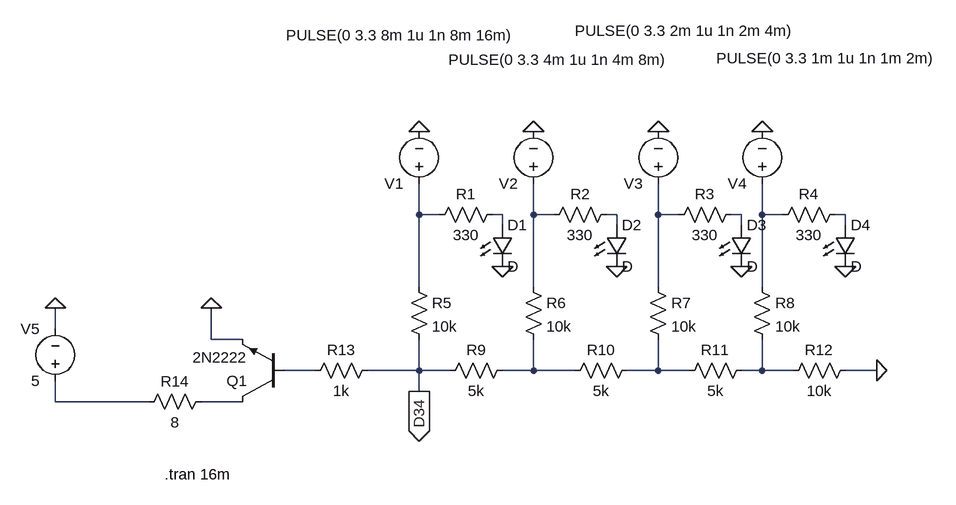
[diagram p0: schematic DAC 1.asc]
DAC 1.asc, the LTspice schematic file:
Version 4.1
SHEET 1 1176 680
WIRE 288 48 288 0
WIRE 320 48 288 48
WIRE 416 48 400 48
WIRE 464 48 464 0
WIRE 496 48 464 48
WIRE 592 48 576 48
WIRE 656 48 656 0
WIRE 688 48 656 48
WIRE 784 48 768 48
WIRE 816 48 816 0
WIRE 848 48 816 48
WIRE 944 48 928 48
WIRE 416 64 416 48
WIRE 592 64 592 48
WIRE 784 64 784 48
WIRE 944 64 944 48
WIRE 288 160 288 48
WIRE 464 160 464 48
WIRE 656 160 656 48
WIRE 816 160 816 48
WIRE -272 224 -272 192
WIRE -32 240 -32 192
WIRE 16 240 -32 240
WIRE 128 288 80 288
WIRE 288 288 288 240
WIRE 288 288 208 288
WIRE 336 288 288 288
WIRE 464 288 464 240
WIRE 464 288 416 288
WIRE 528 288 464 288
WIRE 656 288 656 240
WIRE 656 288 608 288
WIRE 704 288 656 288
WIRE 816 288 816 240
WIRE 816 288 784 288
WIRE 864 288 816 288
WIRE 992 288 944 288
WIRE 288 320 288 288
WIRE -272 336 -272 304
WIRE -128 336 -272 336
WIRE 16 336 -48 336
FLAG 992 288 0
FLAG 288 -80 0
FLAG 464 -80 0
FLAG 656 -80 0
FLAG 816 -80 0
FLAG 416 128 0
FLAG 592 128 0
FLAG 784 128 0
FLAG 944 128 0
FLAG -32 192 0
FLAG -272 192 0
FLAG 288 320 D34
IOPIN 288 320 Out
SYMBOL res 272 144 R0
SYMATTR InstName R5
SYMATTR Value 10k
SYMBOL res 448 144 R0
SYMATTR InstName R6
SYMATTR Value 10k
SYMBOL res 640 144 R0
SYMATTR InstName R7
SYMATTR Value 10k
SYMBOL res 800 144 R0
SYMATTR InstName R8
SYMATTR Value 10k
SYMBOL res 432 272 R90
WINDOW 0 0 56 VBottom 2
WINDOW 3 32 56 VTop 2
SYMATTR InstName R9
SYMATTR Value 5k
SYMBOL res 624 272 R90
WINDOW 0 0 56 VBottom 2
WINDOW 3 32 56 VTop 2
SYMATTR InstName R10
SYMATTR Value 5k
SYMBOL res 800 272 R90
WINDOW 0 0 56 VBottom 2
WINDOW 3 32 56 VTop 2
SYMATTR InstName R11
SYMATTR Value 5k
SYMBOL res 960 272 R90
WINDOW 0 0 56 VBottom 2
WINDOW 3 32 56 VTop 2
SYMATTR InstName R12
SYMATTR Value 10k
SYMBOL voltage 288 16 R180
WINDOW 123 0 0 Left 0
WINDOW 39 0 0 Left 0
WINDOW 3 -146 244 Left 2
SYMATTR InstName V1
SYMATTR Value PULSE(0 3.3 8m 1u 1n 8m 16m)
SYMBOL voltage 464 16 R180
WINDOW 123 0 0 Left 0
WINDOW 39 0 0 Left 0
WINDOW 3 -207 207 Left 2
SYMATTR InstName V2
SYMATTR Value PULSE(0 3.3 4m 1u 1n 4m 8m)
SYMBOL voltage 656 16 R180
WINDOW 123 0 0 Left 0
WINDOW 39 0 0 Left 0
WINDOW 3 -209 251 Left 2
SYMATTR InstName V3
SYMATTR Value PULSE(0 3.3 2m 1u 1n 2m 4m)
SYMBOL voltage 816 16 R180
WINDOW 123 0 0 Left 0
WINDOW 39 0 0 Left 0
WINDOW 3 -267 209 Left 2
SYMATTR InstName V4
SYMATTR Value PULSE(0 3.3 1m 1u 1n 1m 2m)
SYMBOL res 416 32 R90
WINDOW 0 0 56 VBottom 2
WINDOW 3 32 56 VTop 2
SYMATTR InstName R1
SYMATTR Value 330
SYMBOL res 592 32 R90
WINDOW 0 0 56 VBottom 2
WINDOW 3 32 56 VTop 2
SYMATTR InstName R2
SYMATTR Value 330
SYMBOL res 784 32 R90
WINDOW 0 0 56 VBottom 2
WINDOW 3 32 56 VTop 2
SYMATTR InstName R3
SYMATTR Value 330
SYMBOL res 944 32 R90
WINDOW 0 0 56 VBottom 2
WINDOW 3 32 56 VTop 2
SYMATTR InstName R4
SYMATTR Value 330
SYMBOL LED 400 64 R0
SYMATTR InstName D1
SYMBOL LED 576 64 R0
SYMATTR InstName D2
SYMBOL LED 768 64 R0
SYMATTR InstName D3
SYMBOL LED 928 64 R0
SYMATTR InstName D4
SYMBOL npn 80 336 R180
SYMATTR InstName Q1
SYMATTR Value 2N2222
SYMBOL res -32 320 R90
WINDOW 0 0 56 VBottom 2
WINDOW 3 32 56 VTop 2
SYMATTR InstName R14
SYMATTR Value 8
SYMBOL voltage -272 320 R180
WINDOW 0 24 96 Left 2
WINDOW 3 24 16 Left 2
WINDOW 123 0 0 Left 0
WINDOW 39 0 0 Left 0
SYMATTR InstName V5
SYMATTR Value 5
SYMBOL res 224 272 R90
WINDOW 0 0 56 VBottom 2
WINDOW 3 32 56 VTop 2
SYMATTR InstName R13
SYMATTR Value 1k
TEXT -104 448 Left 2 !.tran 16m

The netlist it stands for:
* DAC 1.asc
R5 N001 D34 10k
R6 N003 N010 10k
R7 N005 N011 10k
R8 N007 N012 10k
R9 N010 D34 5k
R10 N011 N010 5k
R11 N012 N011 5k
R12 0 N012 10k
V1 N001 0 PULSE(0 3.3 8m 1u 1n 8m 16m)
V2 N003 0 PULSE(0 3.3 4m 1u 1n 4m 8m)
V3 N005 0 PULSE(0 3.3 2m 1u 1n 2m 4m)
V4 N007 0 PULSE(0 3.3 1m 1u 1n 1m 2m)
R1 N002 N001 330
R2 N004 N003 330
R3 N006 N005 330
R4 N008 N007 330
D1 N002 0 D
D2 N004 0 D
D3 N006 0 D
D4 N008 0 D
Q1 N014 N009 0 0 2N2222
R14 N014 N013 8
V5 N013 0 5
R13 D34 N009 1k
.model D D
.lib standard.dio
.model NPN NPN
.model PNP PNP
.lib standard.bjt
.tran 16m
.backanno
.end